# EAGLE design TPS53819A-5v (EAGLE 7.3.0)
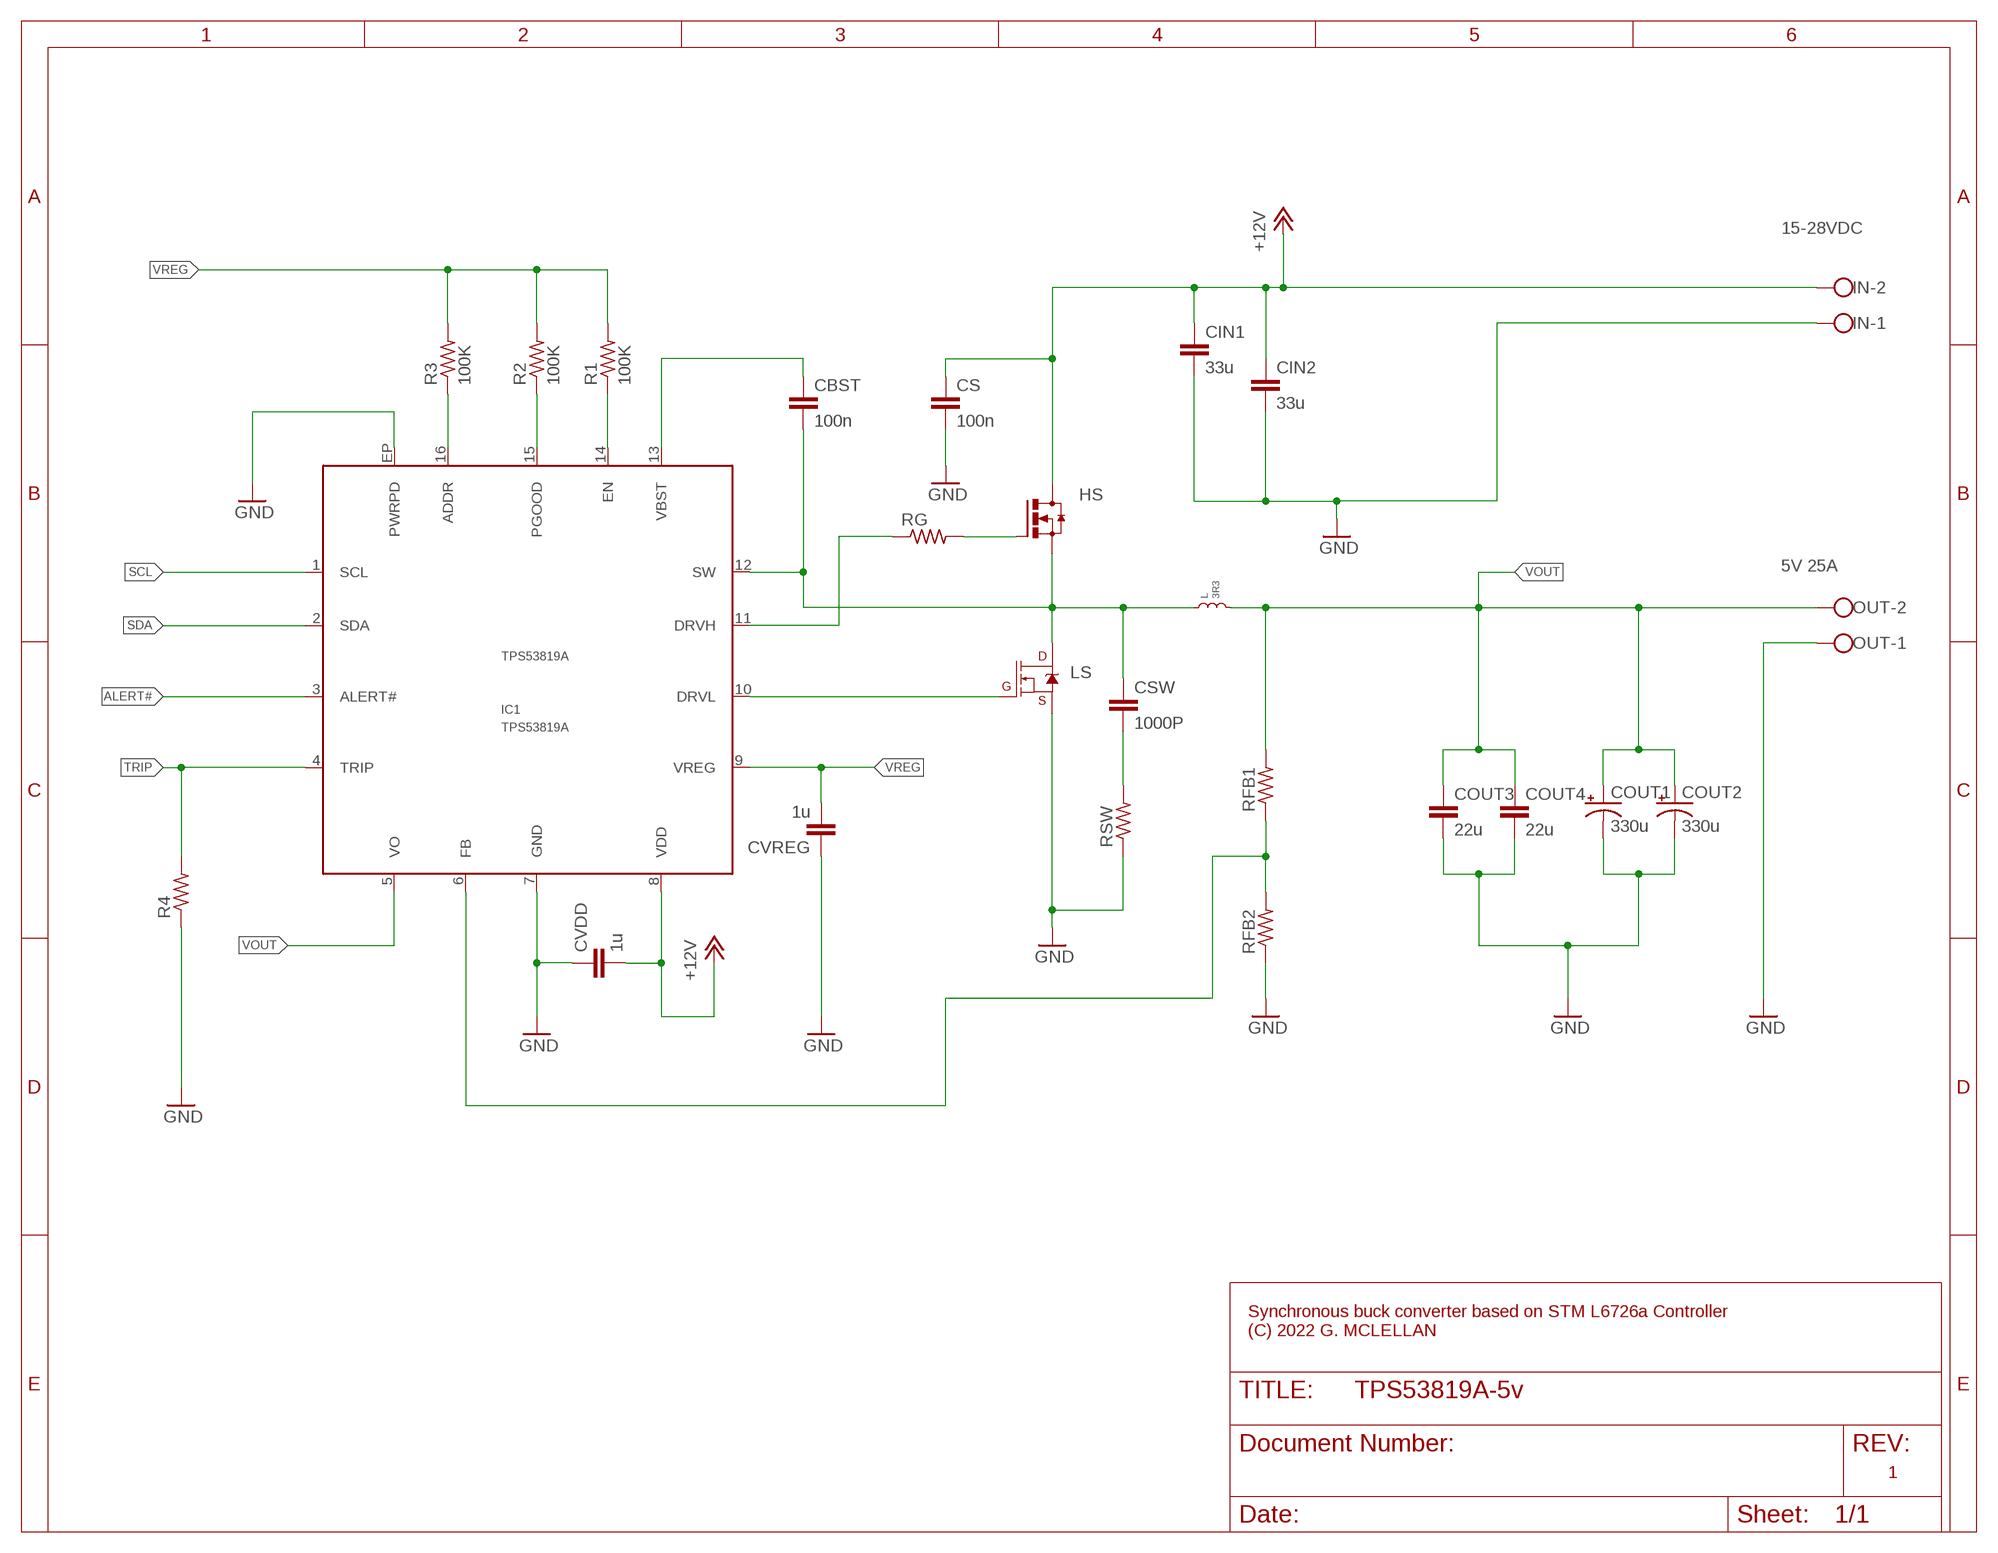
[diagram p0: schematic, sheet 1]

## Parts
CBST  100n  C-EUC0603  [C0603]
CIN1  33u  C-EUC2220K  [C2220K]
CIN2  33u  C-EUC2220K  [C2220K]
COUT1  330u  CPOL-USSANYO_SMD_C6  [SANYO-OSCON_SMD_C6]
COUT2  330u  CPOL-USSANYO_SMD_C6  [SANYO-OSCON_SMD_C6]
COUT3  22u  C-EUC1206  [C1206]
COUT4  22u  C-EUC1206  [C1206]
CS  100n  C-EUC0805  [C0805]
CSW  1000P  C-EUC0603  [C0603]
CVDD  1u  C-EUC0805  [C0805]
CVREG  1u  C-EUC0603  [C0603]
HS  N_MOSFET_POWERSO8  [POWERSO8]
IC1  TPS53819A  [QFN-16]
IN  W237-102  [W237-102]
L  3R3  INDUCTOR.XAL1010  [XAL1010]
LS  MOSFET-NCH-FDS6630A  [SO08]
OUT  W237-102  [W237-102]
R1  100K  R-US_R0603  [R0603]
R2  100K  R-US_R0603  [R0603]
R3  100K  R-US_R0603  [R0603]
R4  R-US_R0603  [R0603]
RFB1  R-US_R0805  [R0805]
RFB2  R-US_R0805  [R0805]
RG  R-US_R0603  [R0603]
RSW  R-US_R0603  [R0603]

## Nets
ADDR: IC1.16(ADDR) R3.1
ALERT#: IC1.3(ALERT#)
DRVH: HS.4(G) RG.2
DRVH`: IC1.11(DRVH) RG.1
DRVL: IC1.10(DRVL) LS.4(G)
EN: IC1.14(EN) R1.1
FB: IC1.6(FB) RFB1.1 RFB2.2
GND: CIN1.2 CIN2.2 COUT1.- COUT2.- COUT3.2 COUT4.2 CS.2 CVDD.1 CVREG.1 IC1.7(GND) IC1.EP(PWRPD) IN.1 LS.1(S) LS.2(S) LS.3(S) OUT.1 R4.1 RFB2.1 RSW.1
N$4: CSW.2 RSW.2
PGOOD: IC1.15(PGOOD) R2.1
SCL: IC1.1(SCL)
SDA: IC1.2(SDA)
SW: CBST.2 CSW.1 HS.1(S) HS.2(S) HS.3(S) IC1.12(SW) L.P$1 LS.5(D) LS.6(D) LS.7(D) LS.8(D)
TRIP: IC1.4(TRIP) R4.2
VBST: CBST.1 IC1.13(VBST)
VDD: CIN1.1 CIN2.1 CS.1 CVDD.2 HS.5(D) HS.6(D) HS.7(D) HS.8(D) HS.PAD(D) IC1.8(VDD) IN.2 ; supply symbol labelled +12V
VOUT: COUT1.+ COUT2.+ COUT3.1 COUT4.1 IC1.5(VO) L.P$2 OUT.2 RFB1.2
VREG: CVREG.2 IC1.9(VREG) R1.2 R2.2 R3.2

## Notes on the sheet
- 15-28VDC
- 5V 25A
- Synchronous buck converter based on STM L6726a Controller
  (C) 2022 G. MCLELLAN
- 1

## Library data of the parts
CBST CIN1 CIN2 COUT3 COUT4 CS CSW CVDD CVREG = rcl:C-EU: CAPACITOR, European symbol
COUT1 COUT2 = rcl:CPOL-US: POLARIZED CAPACITOR, American symbol
HS = power-mosfet:N_MOSFET_POWERSO8
IC1 = TPS53819A:TPS53819A: The TPS53819A device is a small-sized, single buck controller with adaptive on-time D-CAP2 mode control and PMBus. The device is suitable for low output voltage and high current, system power rail, or similar point-of-load (POL) power supply in digital consumer products. Small package with minimal pin-count saves space on the PCB, while the programmability and fault report via PMBus simplify the power supply design. The skip-mode at light-load condition combined with strong gate drivers and low-side FET on-resistance (RDS(on)) current sensing can support low-loss and high efficiency operation, over a broad load range. The conversion input voltage, which is the high-side FET drain voltage, ranges from 3 V to 28 V. The supply voltage (VDD) is from 4.5 V to 28 V. The output voltage ranges from 0.6 V to 5.5 V. The device is available in a 16-pin, QFN package and is specified from –40°C to +85°C.
IN OUT = con-wago-500:W237-102: WAGO SCREW CLAMP; MPN: 237-102; OC_FARNELL: unknown; OC_NEWARK: 70K9898
L = coilcraft:INDUCTOR
LS = SparkFun-DiscreteSemi:MOSFET-NCH: N-channel MOSFETs Voltage controlled devices that allow control of high current outputs. SparkFun Products: SparkFun OpenScale <https://www.sparkfun.com/products/13261> SparkFun Digital Sandbox <https://www.sparkfun.com/products/12651> SparkFun Monster Moto Shield <https://www.sparkfun.com/products/10182> SparkFun MOSFET Power Controller <https://www.sparkfun.com/products/11214>; PROD_ID: TRANS-08089; VALUE: 6.5A/30V/38mΩ
R1-R4 RFB1 RFB2 RG RSW = rcl:R-US_: RESISTOR, American symbol

## Board
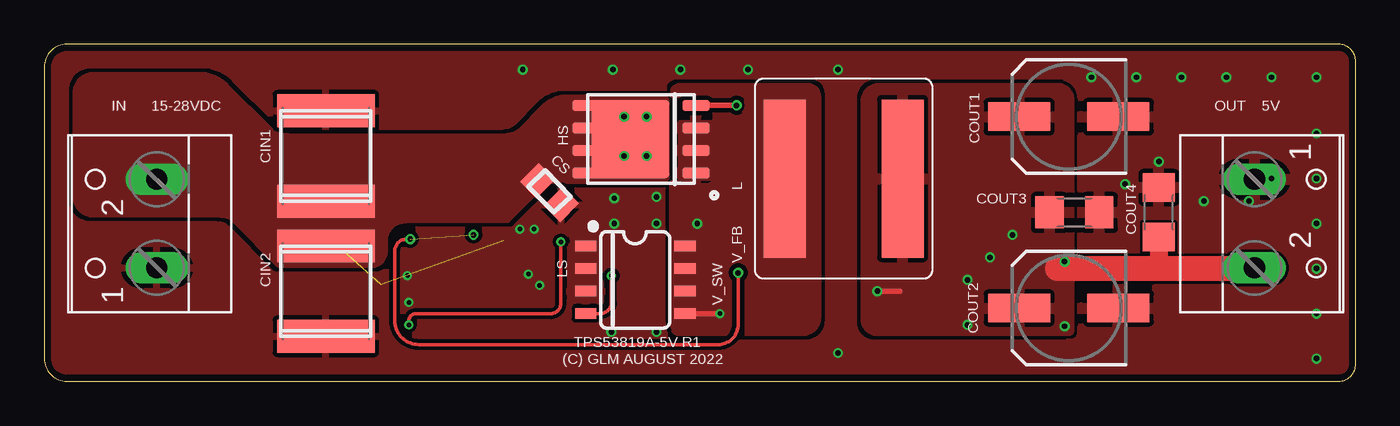
[diagram p1: board, top side]
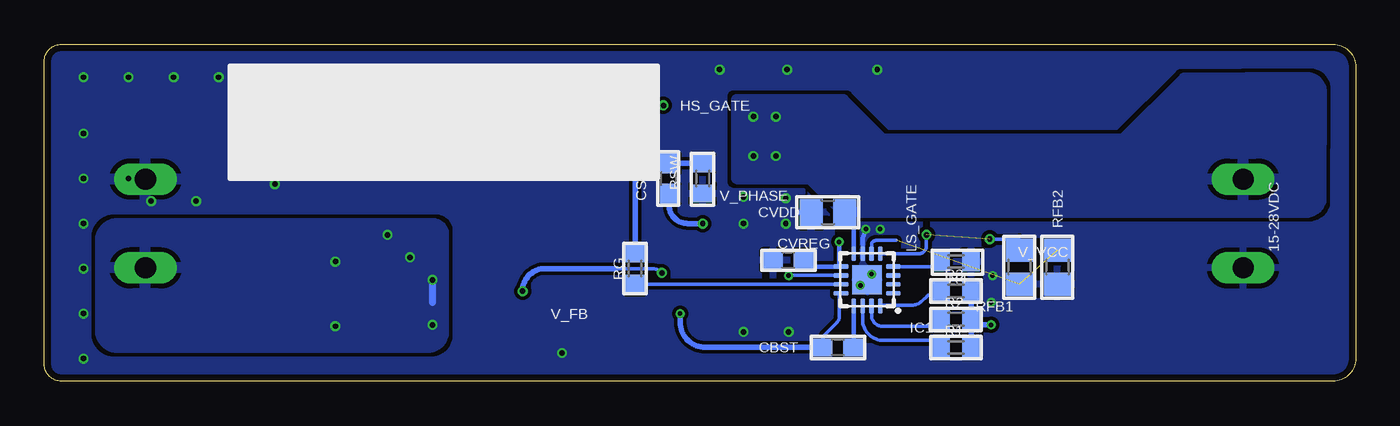
[diagram p2: board, bottom side, seen from below]

Size 73.97 x 19 mm. Coordinates in mm from the lower left corner, seen from the top.
Outline: 0,17.73 0,1.27 arc90 1.27,0 73,0 arc90 73.97,0.96 73.97,18.03 arc90 73,19 1.27,19 arc90 0,17.73
Copper layers (1*16): Top 0.035559375mm / dielectric 1.6mm / Bottom 0.035559375mm
Design rules "oshpark-2layer": minimum track width 6mil, minimum drill 10mil, track to track 6mil, track to pad 6mil, pad to pad 6mil, via to via 6mil, smd to smd 6mil, copper to edge 15mil, drill to drill 6mil, minimum pad ring 5mil, minimum via ring 5mil, stop-mask expansion 2.5mil, vias tented up to drill 0mil, thermal gap 10mil

### Footprints (pad centres in the part's own frame; a part is rotated, then mirrored left to right if it is on the bottom)
C0603 = smd 1.1 x 1: 1 -0.85,0; 2 0.85,0
C2220K = smd 1.85 x 5.5: 1 -2.55,0; 2 2.55,0
SANYO-OSCON_SMD_C6 = smd 3.5 x 1.6: + 2.8,0; - -2.8,0
C1206 = smd 1.6 x 1.8: 1 -1.4,0; 2 1.4,0
C0805 = smd 1.3 x 1.5: 1 -0.95,0; 2 0.95,0
POWERSO8 = smd 1.5 x 0.6: 1 -3.1,1.905; 2 -3.1,0.635; 3 -3.1,-0.635; 4 -3.1,-1.905; 5 3.1,-1.905; 6 3.1,-0.635; 7 3.1,0.635; 8 3.1,1.905 | smd 4.4 x 4.4: PAD 0.6,0
QFN-16 = smd 0.85 x 0.28: 1 -1.475,0.75; 2 -1.475,0.25; 3 -1.475,-0.25; 4 -1.475,-0.75; 9 1.475,-0.75; 10 1.475,-0.25; 11 1.475,0.25; 12 1.475,0.75 | smd 0.28 x 0.85: 5 -0.75,-1.475; 6 -0.25,-1.475; 7 0.25,-1.475; 8 0.75,-1.475; 13 0.75,1.475; 14 0.25,1.475; 15 -0.25,1.475; 16 -0.75,1.475 | smd 1.65 x 1.65: EP 0,0
W237-102 = drill 1.194 long: 1 -2.5,-1.27; 2 2.5,-1.27
XAL1010 = smd 2.38 x 8.91: P$1 -3.325,0; P$2 3.325,0
SO08 = smd 0.6 x 1.2: 1 -1.905,-2.8; 2 -0.635,-2.8; 3 0.635,-2.8; 4 1.905,-2.8; 5 1.905,2.8; 6 0.635,2.8; 7 -0.635,2.8; 8 -1.905,2.8
R0603 = smd 1 x 1.1: 1 -0.85,0; 2 0.85,0
R0805 = smd 1.3 x 1.5: 1 -0.95,0; 2 0.95,0

### Placement (x,y rotation side)
CBST  29.21,1.91 180 bottom
CIN1  15.88,12.7 90 top
CIN2  15.88,5.08 270 top
COUT1  57.78,14.92 180 top
COUT2  57.78,4.13 180 top
COUT3  58.1,9.53 0 top
COUT4  62.87,9.53 90 top
CS  28.5,10.64 315 top
CSW  38.73,11.43 90 bottom
CVDD  29.77,9.53 0 bottom
CVREG  32,6.83 0 bottom
HS  33.66,13.65 180 top
IC1  27.56,5.71 180 bottom
IN  5.08,8.89 90 top
L  45.08,11.43 0 top
LS  33.34,5.71 270 top
OUT  69.53,8.89 270 top
R1  22.54,1.91 0 bottom
R2  22.54,3.49 0 bottom
R3  22.54,5.08 0 bottom
R4  22.54,6.75 180 bottom
RFB1  18.97,6.43 90 bottom
RFB2  16.83,6.43 90 bottom
RG  40.64,6.35 90 bottom
RSW  36.83,11.43 90 bottom

### Tracks (layer width: path | path; a pad name or v marks a point on that pad's centre or on a via)
ADDR
  Bottom 0.203: IC1.16 26.76,4.29 25.04,4.29 arc-45 24.43,4.54 24.17,4.8 arc45 24.02,4.87 23.39,4.87 R3.1
DRVH  (via drill 0.3)
  Top 0.305: HS.4 v39.05,15.56
  Bottom 0.305: v39.05,15.56 39.69,15.56 arc-90 40.64,14.61 RG.2
DRVH`
  Bottom 0.203: IC1.11 40.64,5.46
  Bottom 0.254: RG.1 40.64,5.46
DRVL  (via drill 0.25)
  Top 0.203: LS.4 31.35,3.81 arc90 31.99,4.45 v31.99,5.95
  Top 0.305: LS.4 30.69,3.81
  Bottom 0.203: IC1.10 31.99,5.96 v31.99,5.95
EN
  Bottom 0.203: IC1.14 27.81,3.47 arc-90 26.64,2.3 23.79,2.3 R1.1
FB  (2 unrouted)
  Bottom 0.203: IC1.6 27.31,7.69 arc90 27.05,7.94 25.9,7.94
GND  (via drill 0.25, 0.3)
  Bottom 0.254: IC1.7 27.81,8.07 v27.62,8.57
  other vias: 59.06,17.14 60.96,11.11 62.87,12.38 61.59,17.14 26.99,17.58 32.07,17.58 35.88,17.58 39.69,17.58 44.77,17.58 64.14,17.14 66.67,17.14 65.41,10.16 67.95,10.16 69.22,11.43 71.76,11.43 71.76,13.97 69.22,17.14 71.76,6.35 71.76,1.27 44.77,1.59 27.31,6.03 27.94,5.4 32.15,10.32 34.53,10.4 32.15,8.89 34.53,8.89 31.99,2.78 34.53,2.78 26.83,8.57 71.76,17.14 71.76,3.81 71.76,8.89 20.48,5.95 20.56,4.45
  pour Top (rank 5): 57.78,2.69 57.78,17.14 arc-90 58.42,17.78 72.39,17.78 arc-90 73.03,17.14 73.03,1.91 arc-90 72.39,1.27 59.2,1.27 arc-90
  pour Bottom (rank 5): 51.44,10.16 51.44,17.14 arc-90 52.07,17.78 69.85,17.78 arc-90 70.48,17.14 70.48,10.16
  pour Bottom (isolate 0.203, rank 6): 0,19.05 74.3,19.05 74.3,0 0,0
  pour Top (isolate 0.203, rank 6): 0,19.05 74.3,19.05 74.3,0 0,0
  pour Top (isolate 0.254, rank 5, no thermals): 29.61,4.45 31.43,4.45 31.43,8.18 29.61,8.18
N$4
  Bottom 0.305: RSW.2 CSW.2
PGOOD
  Bottom 0.203: IC1.15 27.31,3.73 arc-90 26.67,3.1 23.79,3.1 R2.1
SW  (via drill 0.25, 0.3)
  Top 0.305: v38.1,3.81 LS.5
  Bottom 0.203: IC1.12 29.13,4.96 29.13,3.61 arc45 29.25,3.31 29.93,2.64 arc-45 30.06,2.32 CBST.2
  Bottom 0.305: v36.83,8.89 37.67,8.89 arc90 38.73,9.96 CSW.1 | CBST.2 36.68,1.91 arc90 38.1,3.33 v38.1,3.81
  pour Top (isolate 0.254, rank 4): 42.79,2.86 35.85,2.86 arc-90 35.56,3.14 35.56,16.19 arc-90 35.88,16.51 43.05,16.51 arc-90 43.5,16.06 43.5,3.57 arc-90
  pour Top (isolate 0.254, rank 5, no thermals): 37.78,14.61 35.88,14.61 35.88,11.43 37.78,11.43
  pour Top (isolate 0.254, rank 4, no thermals): 37.15,2.86 37.15,8.26 35.4,8.26 35.4,3.18 arc90 35.89,2.86
  pour Top (rank 2, no thermals): 40,16.19 43.18,16.19 arc-90 43.5,15.88 43.5,7.3 arc-90 42.86,6.67 40.32,6.67 arc-90 39.69,7.3 39.69,15.88 arc-90
TRIP
  Bottom 0.203: IC1.4 23.39,6.46 R4.2
VBST
  Bottom 0.254: IC1.13 28.31,1.91 CBST.1
VDD  (via drill 0.3)
  Bottom 0.254: IC1.8 28.31,9.53 CVDD.2
  other vias: 33.97,14.92 33.97,12.7 32.7,14.92 32.7,12.7
  pour Top (isolate 0.254, rank 4, no thermals): 13.34,6.66 10.81,9.19 arc45 10,9.53 2.8,9.53 arc-90 1.9,10.42 1.9,16.25 arc-90 2.8,17.14 8.72,17.14 arc-45 10.13,16.56 12.54,14.15 arc45 13.69,13.67 26.11,13.7 arc46 27.02,14.08 28.24,15.33 arc-46 29.54,15.88 34.92,15.88 34.92,11.43 28.26,11.43 26.04,9.21 20.36,9.21 arc90 19.05,7.9 19.05,7.31 arc-90 18.41,6.67
  pour Bottom (isolate 0.254, rank 4): 9.57,9.53 2.81,9.53 arc-90 1.93,10.4 1.91,16.24 arc-90 2.81,17.14 9.67,17.09 13.15,13.65 26.67,13.65 28.89,15.88 34.92,15.88 34.92,11.43 30.8,11.43 28.89,9.53 13.97,9.53 13.08,9.51
VOUT  (via drill 0.3)  (1 unrouted)
  Top 0.203: v39.13,6.11 39.13,3.2 arc-90 38,2.06 21.12,2.06 arc-90 19.76,3.42 19.76,7.33 arc-90 20.45,8.02 v20.64,8.02
  Top 0.305: v46.99,5.08 48.26,5.08
  Top 1.016: COUT4.1 62.87,6.35 62.23,6.35
  Top 1.422: OUT.2 68.26,6.35 62.23,6.35 57.15,6.35
  Bottom 0.203: IC1.5 24.65,7.19 arc-90 24.21,7.63 v24.21,8.26 | v39.13,6.11 arc-45 39.71,6.35 41.67,6.35 | v20.64,8.02 18.97,8.02 RFB1.2
  Bottom 0.305: 41.67,6.35 45.72,6.35 arc-90 v46.99,5.08
  Bottom 0.406: 52.07,4.45 v52.07,5.71
  other vias: 57.55,3.1 52.07,3.17 53.34,6.99 54.61,8.26 57.55,6.75
  pour Top (rank 4): 57.78,15.88 57.78,2.86 46.99,2.86 arc-90 46.36,3.49 46.36,15.8 arc-90 47.06,16.51 57.15,16.51 arc-90
  pour Bottom (rank 4): 52.07,8.89 69.84,8.89 arc-90 70.8,7.93 70.8,2.86 arc-90 69.85,1.91 52.33,1.91 arc-90 51.44,2.8 51.44,8.26 arc-90
VREG  (via drill 0.25)
  Top 0.203: v20.56,3.17 20.56,3.4 arc-90 20.96,3.81 28.56,3.81 arc90 29.13,4.38 v29.13,7.86
  Bottom 0.203: 30.98,6.46 CVREG.2
  Bottom 0.254: 29.13,6.46 31.15,6.46 CVREG.2 | 29.13,6.46 IC1.9 | 29.13,6.46 v29.13,7.86
  Bottom 0.305: R2.2 R1.2 | R3.2 R2.2 | v20.56,3.17 21.69,3.17 R2.2

### Text on the board
tNames: 15-28VDC | 5V | V_FB | V_SW | TPS53819A-5V R1 | (C) GLM AUGUST 2022
bNames: HS_GATE | V_PHASE | 15-28VDC | V_VCC | LS_GATE | V_FB